# Altium project Phaser_DIOT.PrjPCB (part 4 of 10)

## Sheet DAC.SchDoc: =P_Title
size 420 x 297 mm; EDA_Number: ARTIQ; Projet: ARTIQ/SINARA; Author: G.Kasprowicz; CompanyName: WUT ISE; DrawnBy: G.Kasprowicz; Organization: WUT ISE; Address1: PW ISE; Address2: Nowowiejska 15/19 00-665 Warsaw; Address3: gkasprow@gmail.com; DocumentNumber: 6; Revision: 2; SheetNumber: 6; SheetTotal: 19; ModifiedBy: -; CheckedDate: -; Title2: DAC & filters; DivGrp: WUT ISE; Designer: G.Kasprowicz; ModifiedDate: -; ProjectName: Sensor Box
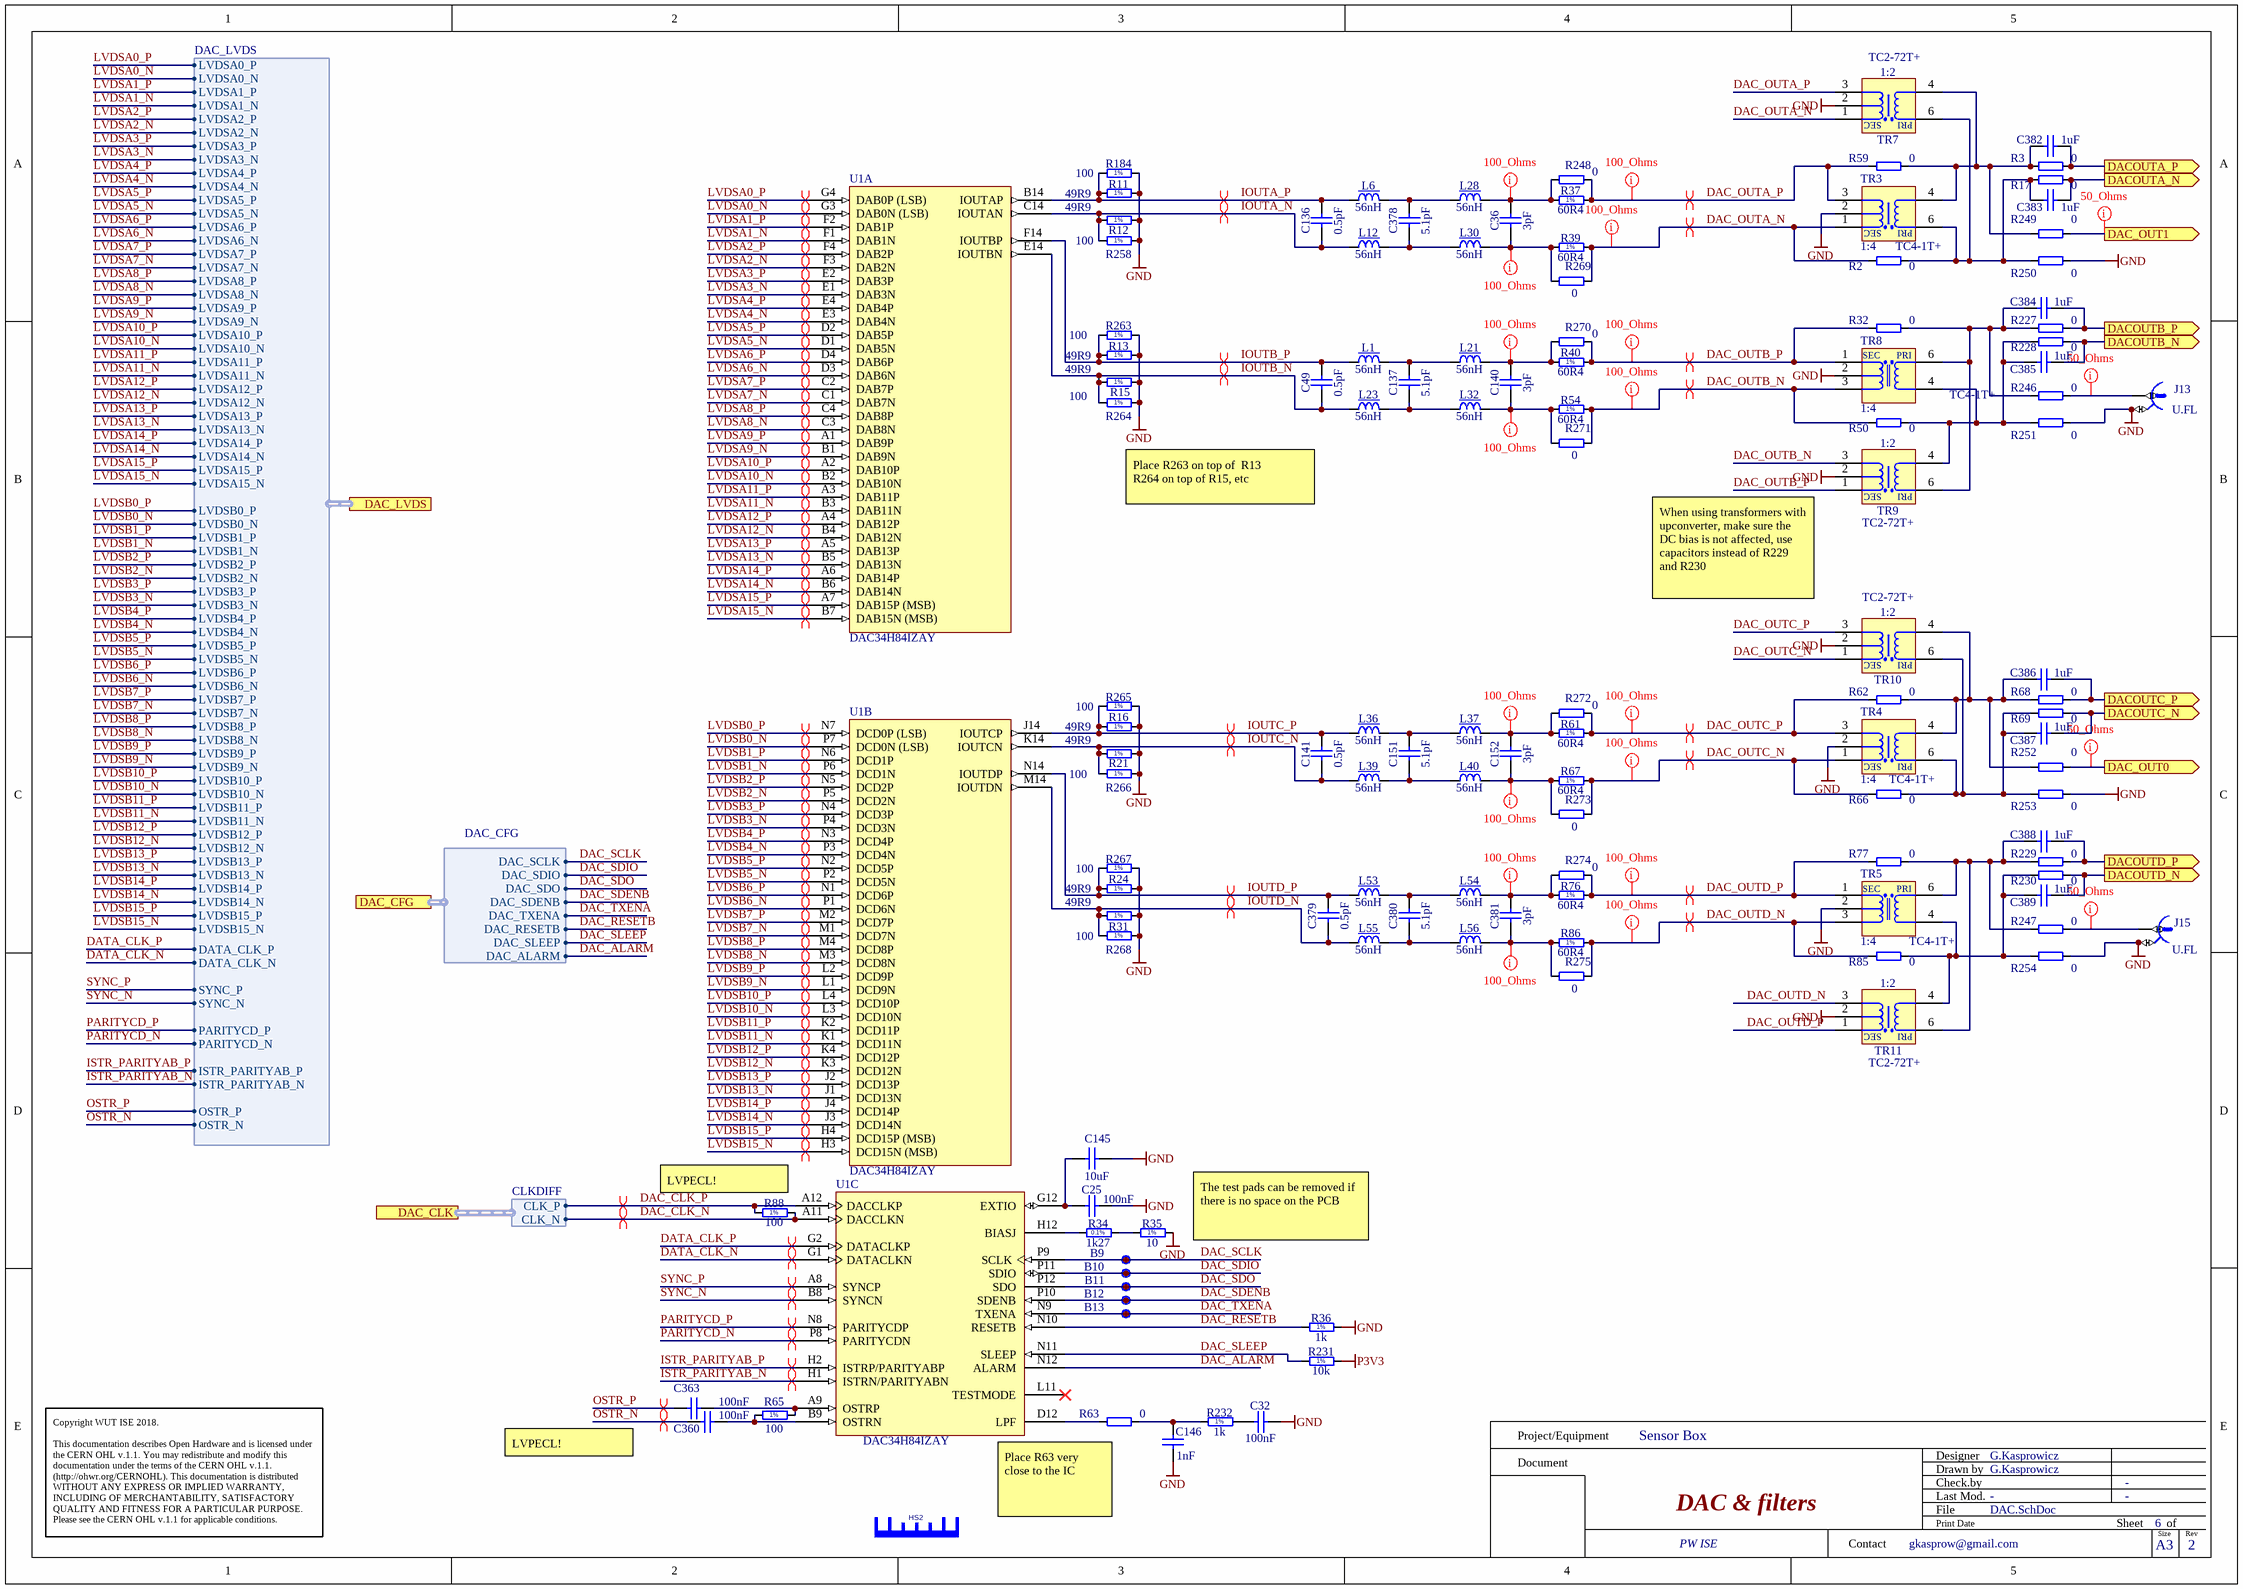
[diagram p7: DAC.SchDoc]

### Parts
B9  SMD Pad  [C100]  (value not drawn)
B10  SMD Pad  [C100]  (value not drawn)
B11  SMD Pad  [C100]  (value not drawn)
B12  SMD Pad  [C100]  (value not drawn)
B13  SMD Pad  [C100]  (value not drawn)
C25  100nF  [CAPC1005X55N]
C32  100nF  [CAPC1608X90N]
C36  3pF  [CAPC1608X87N]
C49  0.5pF  [CAPC1608X87N]
C136  0.5pF  [CAPC1608X87N]
C137  5.1pF  [CAPC1608X87N]
C140  3pF  [CAPC1608X87N]
C141  0.5pF  [CAPC1608X87N]
C145  10uF  [CAPC2012X95N]
C146  1nF  [CAPC1608X90N]
C151  5.1pF  [CAPC1608X87N]
C152  3pF  [CAPC1608X87N]
C360  100nF  [CAPC1005X55N]
C363  100nF  [CAPC1005X55N]
C378  5.1pF  [CAPC1608X87N]
C379  0.5pF  [CAPC1608X87N]
C380  5.1pF  [CAPC1608X87N]
C381  3pF  [CAPC1608X87N]
C382  1uF  [CAPC1005X55N]
C383  1uF  [CAPC1005X55N]
C384  1uF  [CAPC1005X55N]
C385  1uF  [CAPC1005X55N]
C386  1uF  [CAPC1005X55N]
C387  1uF  [CAPC1005X55N]
C388  1uF  [CAPC1005X55N]
C389  1uF  [CAPC1005X55N]
HS2  Heat Sink No Pad  [HSINK_HSB03-121218]  (value not drawn)
J13  U.FL  [HIROSE_U.FL-R-SMT-1(10)]
J15  U.FL  [HIROSE_U.FL-R-SMT-1(10)]
L1  56nH  [IND_MURATA_LQW18AS_0Z]
L6  56nH  [IND_MURATA_LQW18AS_0Z]
L12  56nH  [IND_MURATA_LQW18AS_0Z]
L21  56nH  [IND_MURATA_LQW18AS_0Z]
L23  56nH  [IND_MURATA_LQW18AS_0Z]
L28  56nH  [IND_MURATA_LQW18AS_0Z]
L30  56nH  [IND_MURATA_LQW18AS_0Z]
L32  56nH  [IND_MURATA_LQW18AS_0Z]
L36  56nH  [IND_MURATA_LQW18AS_0Z]
L37  56nH  [IND_MURATA_LQW18AS_0Z]
L39  56nH  [IND_MURATA_LQW18AS_0Z]
L40  56nH  [IND_MURATA_LQW18AS_0Z]
L53  56nH  [IND_MURATA_LQW18AS_0Z]
L54  56nH  [IND_MURATA_LQW18AS_0Z]
L55  56nH  [IND_MURATA_LQW18AS_0Z]
L56  56nH  [IND_MURATA_LQW18AS_0Z]
R2  0  [RESC1005X40N]
R3  0  [RESC1005X40N]
R11  49R9  [RESC1005X40N]
R12  49R9  [RESC1005X40N]
R13  49R9  [RESC1005X40N]
R15  49R9  [RESC1005X40N]
R16  49R9  [RESC1005X40N]
R17  0  [RESC1005X40N]
R21  49R9  [RESC1005X40N]
R24  49R9  [RESC1005X40N]
R31  49R9  [RESC1005X40N]
R32  0  [RESC1005X40N]
R34  1k27  [RESC1608X55N]
R35  10  [RESC1005X40N]
R36  1k  [RESC1608X55N]
R37  60R4  [RESC1005X40N]
R39  60R4  [RESC1005X40N]
R40  60R4  [RESC1005X40N]
R50  0  [RESC1005X40N]
R54  60R4  [RESC1005X40N]
R59  0  [RESC1005X40N]
R61  60R4  [RESC1005X40N]
R62  0  [RESC1005X40N]
R63  0  [RESC1005X40N]
R65  100  [RESC0603X28N]
R66  0  [RESC1005X40N]
R67  60R4  [RESC1005X40N]
R68  0  [RESC1005X40N]
R69  0  [RESC1005X40N]
R76  60R4  [RESC1005X40N]
R77  0  [RESC1005X40N]
R85  0  [RESC1005X40N]
R86  60R4  [RESC1005X40N]
R88  100  [RESC0603X28N]
R184  100  [RESC1005X40N]
R227  0  [RESC1005X40N]
R228  0  [RESC1005X40N]
R229  0  [RESC1005X40N]
R230  0  [RESC1005X40N]
R231  10k  [RESC1608X55N]
R232  1k  [RESC1608X55N]
R246  0  [RESC1005X40N]
R247  0  [RESC1005X40N]
R248  0  [RESC1005X40N]
R249  0  [RESC1005X40N]
R250  0  [RESC1005X40N]
R251  0  [RESC1005X40N]
R252  0  [RESC1005X40N]
R253  0  [RESC1005X40N]
R254  0  [RESC1005X40N]
R258  100  [RESC1005X40N]
R263  100  [RESC1005X40N]
R264  100  [RESC1005X40N]
R265  100  [RESC1005X40N]
R266  100  [RESC1005X40N]
R267  100  [RESC1005X40N]
R268  100  [RESC1005X40N]
R269  0  [RESC1005X40N]
R270  0  [RESC1005X40N]
R271  0  [RESC1005X40N]
R272  0  [RESC1005X40N]
R273  0  [RESC1005X40N]
R274  0  [RESC1005X40N]
R275  0  [RESC1005X40N]
TR3  1:4  Manufacturer Part Number: TC4-1T+  [XFMR_MINI-CIRCUITS_AT224]
TR4  1:4  Manufacturer Part Number: TC4-1T+  [XFMR_MINI-CIRCUITS_AT224]
TR5  1:4  Manufacturer Part Number: TC4-1T+  [XFMR_MINI-CIRCUITS_AT224]
TR7  1:2  Manufacturer Part Number: TC2-72T+  [XFMR_MINI-CIRCUITS_AT1521]
TR8  1:4  Manufacturer Part Number: TC4-1T+  [XFMR_MINI-CIRCUITS_AT224]
TR9  1:2  Manufacturer Part Number: TC2-72T+  [XFMR_MINI-CIRCUITS_AT1521]
TR10  1:2  Manufacturer Part Number: TC2-72T+  [XFMR_MINI-CIRCUITS_AT1521]
TR11  1:2  Manufacturer Part Number: TC2-72T+  [XFMR_MINI-CIRCUITS_AT1521]
U1  DAC34H84IZAY  [TI-ZAY196]  (parts A,B,C of 5)

### Ports
DAC_CFG (harness DAC_CFG), DAC_CLK (harness CLKDIFF), DAC_LVDS (harness DAC_LVDS), DAC_OUT0 (out), DAC_OUT1 (out), DACOUTA_N (out), DACOUTA_P (out), DACOUTB_N (out), DACOUTB_P (out), DACOUTC_N (out), DACOUTC_P (out), DACOUTD_N (out), DACOUTD_P (out)

### Harnesses
DAC_CFG: DAC_SCLK, DAC_SDIO, DAC_SDO, DAC_SDENB, DAC_TXENA, DAC_RESETB, DAC_SLEEP, DAC_ALARM
CLKDIFF: CLK_N, CLK_P
DAC_LVDS: LVDSA0_P, LVDSA0_N, LVDSA1_P, LVDSA1_N, LVDSA2_P, LVDSA2_N, LVDSA3_P, LVDSA3_N, LVDSA4_P, LVDSA4_N, LVDSA5_P, LVDSA5_N, LVDSA6_P, LVDSA6_N, LVDSA7_P, LVDSA7_N, LVDSA8_P, LVDSA8_N, LVDSA9_P, LVDSA9_N, LVDSA10_P, LVDSA10_N, LVDSA11_P, LVDSA11_N, LVDSA12_P, LVDSA12_N, LVDSA13_P, LVDSA13_N, LVDSA14_P, LVDSA14_N, LVDSA15_P, LVDSA15_N, LVDSB0_P, LVDSB0_N, LVDSB1_P, LVDSB1_N, LVDSB2_P, LVDSB2_N, LVDSB3_P, LVDSB3_N, LVDSB4_P, LVDSB4_N, LVDSB5_P, LVDSB5_N, LVDSB6_P, LVDSB6_N, LVDSB7_P, LVDSB7_N, LVDSB8_P, LVDSB8_N, LVDSB9_P, LVDSB9_N, LVDSB10_P, LVDSB10_N, LVDSB11_P, LVDSB11_N, LVDSB12_P, LVDSB12_N, LVDSB13_P, LVDSB13_N, LVDSB14_P, LVDSB14_N, LVDSB15_P, LVDSB15_N, DATA_CLK_P, DATA_CLK_N, SYNC_P, SYNC_N, PARITYCD_P, PARITYCD_N, ISTR_PARITYAB_P, ISTR_PARITYAB_N, OSTR_P, OSTR_N

### Nets
GND: C25.2 C32.2 C145.1 C146.1 J13.2 J15.2 R11.2 R12.2 R13.2 R15.2 R16.2 R21.2 R24.2 R31.2 R35.2 R36.2 R184.2 R250.1 R251.1 R253.1 R254.1 R258.2 R263.2 R264.2 R265.2 R266.2 R267.2 R268.2 TR3.2(SCT) TR4.2(SCT) TR5.2(SCT) TR7.2(NC) TR8.2(SCT) TR9.2(NC) TR10.2(NC) TR11.2(NC)
P3V3: R231.2
BBI_N: C383.2 R17.1 ; port DACOUTA_N
BBI_N: C387.2 R69.1 ; port DACOUTC_N  [a separate net that carries the same name]
BBI_P: C382.2 R3.1 ; port DACOUTA_P
BBI_P: C386.2 R68.1 ; port DACOUTC_P  [a separate net that carries the same name]
BBQ_N: C385.2 R228.1 ; port DACOUTB_N
BBQ_N: C389.2 R230.1 ; port DACOUTD_N  [a separate net that carries the same name]
BBQ_P: C384.2 R227.1 ; port DACOUTB_P
BBQ_P: C388.2 R229.1 ; port DACOUTD_P  [a separate net that carries the same name]
DAC_ALARM: U1.N12(ALARM) ; port DAC_CFG.DAC_ALARM
DAC_CLK_N: R88.2 U1.A11(DACCLKN) ; port DAC_CLK.CLK_N
DAC_CLK_P: R88.1 U1.A12(DACCLKP) ; port DAC_CLK.CLK_P
DAC_OUTA_N: R2.2 R39.2 R269.1 TR3.1(SDOT) TR7.1(SDOT)
DAC_OUTA_P: R37.2 R59.2 R248.1 TR3.3(S) TR7.3(S)
DAC_OUTB_N: R50.2 R54.2 R271.1 TR8.3(S) TR9.3(S)
DAC_OUTB_P: R32.2 R40.2 R270.1 TR8.1(SDOT) TR9.1(SDOT)
DAC_OUTC_N: R66.2 R67.2 R273.1 TR4.1(SDOT) TR10.1(SDOT)
DAC_OUTC_P: R61.2 R62.2 R272.1 TR4.3(S) TR10.3(S)
DAC_OUTD_N: R85.2 R86.2 R275.1 TR5.3(S) TR11.3(S)
DAC_OUTD_P: R76.2 R77.2 R274.1 TR5.1(SDOT) TR11.1(SDOT)
DAC_RESETB: R36.1 U1.N10(RESETB) ; port DAC_CFG.DAC_RESETB
DAC_SCLK: B9.1 U1.P9(SCLK) ; port DAC_CFG.DAC_SCLK
DAC_SDENB: B12.1 U1.P10(SDENB) ; port DAC_CFG.DAC_SDENB
DAC_SDIO: B10.1 U1.P11(SDIO) ; port DAC_CFG.DAC_SDIO
DAC_SDO: B11.1 U1.P12(SDO) ; port DAC_CFG.DAC_SDO
DAC_SLEEP: R231.1 U1.N11(SLEEP) ; port DAC_CFG.DAC_SLEEP
DAC_TXENA: B13.1 U1.N9(TXENA) ; port DAC_CFG.DAC_TXENA
DATA_CLK_N: U1.G1(DATACLKN) ; port DAC_LVDS.DATA_CLK_N
DATA_CLK_P: U1.G2(DATACLKP) ; port DAC_LVDS.DATA_CLK_P
IOUTA_N: C136.1 L12.1 R12.1 R258.1 U1.C14(IOUTAN)
IOUTA_P: C136.2 L6.1 R11.1 R184.1 U1.B14(IOUTAP)
IOUTB_N: C49.1 L23.1 R15.1 R264.1 U1.E14(IOUTBN)
IOUTB_P: C49.2 L1.1 R13.1 R263.1 U1.F14(IOUTBP)
IOUTC_N: C141.1 L39.1 R21.1 R266.1 U1.K14(IOUTCN)
IOUTC_P: C141.2 L36.1 R16.1 R265.1 U1.J14(IOUTCP)
IOUTD_N: C379.1 L55.1 R31.1 R268.1 U1.M14(IOUTDN)
IOUTD_P: C379.2 L53.1 R24.1 R267.1 U1.N14(IOUTDP)
ISTR_PARITYAB_N: U1.H1(ISTRN/PARITYABN) ; port DAC_LVDS.ISTR_PARITYAB_N
ISTR_PARITYAB_P: U1.H2(ISTRP/PARITYABP) ; port DAC_LVDS.ISTR_PARITYAB_P
LVDSA0_N: U1.G3(DAB0N_(LSB)) ; port DAC_LVDS.LVDSA0_N
LVDSA0_P: U1.G4(DAB0P_(LSB)) ; port DAC_LVDS.LVDSA0_P
LVDSA1_N: U1.F1(DAB1N) ; port DAC_LVDS.LVDSA1_N
LVDSA1_P: U1.F2(DAB1P) ; port DAC_LVDS.LVDSA1_P
LVDSA2_N: U1.F3(DAB2N) ; port DAC_LVDS.LVDSA2_N
LVDSA2_P: U1.F4(DAB2P) ; port DAC_LVDS.LVDSA2_P
LVDSA3_N: U1.E1(DAB3N) ; port DAC_LVDS.LVDSA3_N
LVDSA3_P: U1.E2(DAB3P) ; port DAC_LVDS.LVDSA3_P
LVDSA4_N: U1.E3(DAB4N) ; port DAC_LVDS.LVDSA4_N
LVDSA4_P: U1.E4(DAB4P) ; port DAC_LVDS.LVDSA4_P
LVDSA5_N: U1.D1(DAB5N) ; port DAC_LVDS.LVDSA5_N
LVDSA5_P: U1.D2(DAB5P) ; port DAC_LVDS.LVDSA5_P
LVDSA6_N: U1.D3(DAB6N) ; port DAC_LVDS.LVDSA6_N
LVDSA6_P: U1.D4(DAB6P) ; port DAC_LVDS.LVDSA6_P
LVDSA7_N: U1.C1(DAB7N) ; port DAC_LVDS.LVDSA7_N
LVDSA7_P: U1.C2(DAB7P) ; port DAC_LVDS.LVDSA7_P
LVDSA8_N: U1.C3(DAB8N) ; port DAC_LVDS.LVDSA8_N
LVDSA8_P: U1.C4(DAB8P) ; port DAC_LVDS.LVDSA8_P
LVDSA9_N: U1.B1(DAB9N) ; port DAC_LVDS.LVDSA9_N
LVDSA9_P: U1.A1(DAB9P) ; port DAC_LVDS.LVDSA9_P
LVDSA10_N: U1.B2(DAB10N) ; port DAC_LVDS.LVDSA10_N
LVDSA10_P: U1.A2(DAB10P) ; port DAC_LVDS.LVDSA10_P
LVDSA11_N: U1.B3(DAB11N) ; port DAC_LVDS.LVDSA11_N
LVDSA11_P: U1.A3(DAB11P) ; port DAC_LVDS.LVDSA11_P
LVDSA12_N: U1.B4(DAB12N) ; port DAC_LVDS.LVDSA12_N
LVDSA12_P: U1.A4(DAB12P) ; port DAC_LVDS.LVDSA12_P
LVDSA13_N: U1.B5(DAB13N) ; port DAC_LVDS.LVDSA13_N
LVDSA13_P: U1.A5(DAB13P) ; port DAC_LVDS.LVDSA13_P
LVDSA14_N: U1.B6(DAB14N) ; port DAC_LVDS.LVDSA14_N
LVDSA14_P: U1.A6(DAB14P) ; port DAC_LVDS.LVDSA14_P
LVDSA15_N: U1.B7(DAB15N_(MSB)) ; port DAC_LVDS.LVDSA15_N
LVDSA15_P: U1.A7(DAB15P_(MSB)) ; port DAC_LVDS.LVDSA15_P
LVDSB0_N: U1.P7(DCD0N_(LSB)) ; port DAC_LVDS.LVDSB0_N
LVDSB0_P: U1.N7(DCD0P_(LSB)) ; port DAC_LVDS.LVDSB0_P
LVDSB1_N: U1.P6(DCD1N) ; port DAC_LVDS.LVDSB1_N
LVDSB1_P: U1.N6(DCD1P) ; port DAC_LVDS.LVDSB1_P
LVDSB2_N: U1.P5(DCD2N) ; port DAC_LVDS.LVDSB2_N
LVDSB2_P: U1.N5(DCD2P) ; port DAC_LVDS.LVDSB2_P
LVDSB3_N: U1.P4(DCD3N) ; port DAC_LVDS.LVDSB3_N
LVDSB3_P: U1.N4(DCD3P) ; port DAC_LVDS.LVDSB3_P
LVDSB4_N: U1.P3(DCD4N) ; port DAC_LVDS.LVDSB4_N
LVDSB4_P: U1.N3(DCD4P) ; port DAC_LVDS.LVDSB4_P
LVDSB5_N: U1.P2(DCD5N) ; port DAC_LVDS.LVDSB5_N
LVDSB5_P: U1.N2(DCD5P) ; port DAC_LVDS.LVDSB5_P
LVDSB6_N: U1.P1(DCD6N) ; port DAC_LVDS.LVDSB6_N
LVDSB6_P: U1.N1(DCD6P) ; port DAC_LVDS.LVDSB6_P
LVDSB7_N: U1.M1(DCD7N) ; port DAC_LVDS.LVDSB7_N
LVDSB7_P: U1.M2(DCD7P) ; port DAC_LVDS.LVDSB7_P
LVDSB8_N: U1.M3(DCD8N) ; port DAC_LVDS.LVDSB8_N
LVDSB8_P: U1.M4(DCD8P) ; port DAC_LVDS.LVDSB8_P
LVDSB9_N: U1.L1(DCD9N) ; port DAC_LVDS.LVDSB9_N
LVDSB9_P: U1.L2(DCD9P) ; port DAC_LVDS.LVDSB9_P
LVDSB10_N: U1.L3(DCD10N) ; port DAC_LVDS.LVDSB10_N
LVDSB10_P: U1.L4(DCD10P) ; port DAC_LVDS.LVDSB10_P
LVDSB11_N: U1.K1(DCD11N) ; port DAC_LVDS.LVDSB11_N
LVDSB11_P: U1.K2(DCD11P) ; port DAC_LVDS.LVDSB11_P
LVDSB12_N: U1.K3(DCD12N) ; port DAC_LVDS.LVDSB12_N
LVDSB12_P: U1.K4(DCD12P) ; port DAC_LVDS.LVDSB12_P
LVDSB13_N: U1.J1(DCD13N) ; port DAC_LVDS.LVDSB13_N
LVDSB13_P: U1.J2(DCD13P) ; port DAC_LVDS.LVDSB13_P
LVDSB14_N: U1.J3(DCD14N) ; port DAC_LVDS.LVDSB14_N
LVDSB14_P: U1.J4(DCD14P) ; port DAC_LVDS.LVDSB14_P
LVDSB15_N: U1.H3(DCD15N_(MSB)) ; port DAC_LVDS.LVDSB15_N
LVDSB15_P: U1.H4(DCD15P_(MSB)) ; port DAC_LVDS.LVDSB15_P
OSTR_N: C360.1 ; port DAC_LVDS.OSTR_N
OSTR_P: C363.1 ; port DAC_LVDS.OSTR_P
PARITYCD_N: U1.P8(PARITYCDN) ; port DAC_LVDS.PARITYCD_N
PARITYCD_P: U1.N8(PARITYCDP) ; port DAC_LVDS.PARITYCD_P
SYNC_N: U1.B8(SYNCN) ; port DAC_LVDS.SYNC_N
SYNC_P: U1.A8(SYNCP) ; port DAC_LVDS.SYNC_P
NetC25_1: C25.1 C145.2 U1.G12(EXTIO)
NetC32_1: C32.1 R232.2
NetC36_1: C36.1 L30.2 R39.1 R269.2
NetC36_2: C36.2 L28.2 R37.1 R248.2
NetC137_1: C137.1 L23.2 L32.1
NetC137_2: C137.2 L1.2 L21.1
NetC140_1: C140.1 L32.2 R54.1 R271.2
NetC140_2: C140.2 L21.2 R40.1 R270.2
NetC146_2: C146.2 R63.1 R232.1
NetC151_1: C151.1 L39.2 L40.1
NetC151_2: C151.2 L36.2 L37.1
NetC152_1: C152.1 L40.2 R67.1 R273.2
NetC152_2: C152.2 L37.2 R61.1 R272.2
NetC270A_2: R252.1 ; port DAC_OUT0
NetC270B_2: R249.1 ; port DAC_OUT1
NetC360_2: C360.2 R65.1 U1.B9(OSTRN)
NetC363_2: C363.2 R65.2 U1.A9(OSTRP)
NetC378_1: C378.1 L12.2 L30.1
NetC378_2: C378.2 L6.2 L28.1
NetC380_1: C380.1 L55.2 L56.1
NetC380_2: C380.2 L53.2 L54.1
NetC381_1: C381.1 L56.2 R86.1 R275.2
NetC381_2: C381.2 L54.2 R76.1 R274.2
NetC382_1: C382.1 R3.2 R59.1 R249.2 TR3.4(P) TR7.4(P)
NetC383_1: C383.1 R2.1 R17.2 R250.2 TR3.6(PDOT) TR7.6(PDOT)
NetC384_1: C384.1 R32.1 R227.2 R246.2 TR8.6(PDOT) TR9.6(PDOT)
NetC385_1: C385.1 R50.1 R228.2 R251.2 TR8.4(P) TR9.4(P)
NetC386_1: C386.1 R62.1 R68.2 R252.2 TR4.4(P) TR10.4(P)
NetC387_1: C387.1 R66.1 R69.2 R253.2 TR4.6(PDOT) TR10.6(PDOT)
NetC388_1: C388.1 R77.1 R229.2 R247.2 TR5.6(PDOT) TR11.6(PDOT)
NetC389_1: C389.1 R85.1 R230.2 R254.2 TR5.4(P) TR11.4(P)
NetJ13_1: J13.1 R246.1
NetJ15_1: J15.1 R247.1
NetR34_1: R34.1 U1.H12(BIASJ)
NetR34_2: R34.2 R35.1
NetR63_2: R63.2 U1.D12(LPF)

Not connected (* = marked no-connect by the designer): U1 L11(TESTMODE)*

### Layout directives
differential pair; differential pair class I_analog: IOUTA_N, IOUTA_P, IOUTB_N, IOUTB_P, IOUTC_N, IOUTC_P, IOUTD_N, IOUTD_P
differential pair; differential pair class LVPECL: DAC_CLK_N, DAC_CLK_P
differential pair: DAC_OUTA_N, DAC_OUTA_P, DAC_OUTB_N, DAC_OUTB_P, DAC_OUTC_N, DAC_OUTC_P, DAC_OUTD_N, DAC_OUTD_P
net class 100_Ohms: DAC_OUTA_N, DAC_OUTA_P, DAC_OUTB_N, DAC_OUTB_P, DAC_OUTC_N, DAC_OUTC_P, DAC_OUTD_N, DAC_OUTD_P, NetC36_1, NetC36_2, NetC140_1, NetC140_2, NetC152_1, NetC152_2, NetC381_1, NetC381_2
differential pair; differential pair class Diff_100Ohm; net class DAC: DATA_CLK_N, DATA_CLK_P, ISTR_PARITYAB_N, ISTR_PARITYAB_P, LVDSA0_N, LVDSA0_P, LVDSA1_N, LVDSA1_P, LVDSA2_N, LVDSA2_P, LVDSA3_N, LVDSA3_P, LVDSA4_N, LVDSA4_P, LVDSA5_N, LVDSA5_P, LVDSA6_N, LVDSA6_P, LVDSA7_N, LVDSA7_P, LVDSA8_N, LVDSA8_P, LVDSA9_N, LVDSA9_P, LVDSA10_N, LVDSA10_P, LVDSA11_N, LVDSA11_P, LVDSA12_N, LVDSA12_P, LVDSA13_N, LVDSA13_P, LVDSA14_N, LVDSA14_P, LVDSA15_N, LVDSA15_P, LVDSB0_N, LVDSB0_P, LVDSB1_N, LVDSB1_P, LVDSB2_N, LVDSB2_P, LVDSB3_N, LVDSB3_P, LVDSB4_N, LVDSB4_P, LVDSB5_N, LVDSB5_P, LVDSB6_N, LVDSB6_P, LVDSB7_N, LVDSB7_P, LVDSB8_N, LVDSB8_P, LVDSB9_N, LVDSB9_P, LVDSB10_N, LVDSB10_P, LVDSB11_N, LVDSB11_P, LVDSB12_N, LVDSB12_P, LVDSB13_N, LVDSB13_P, LVDSB14_N, LVDSB14_P, LVDSB15_N, LVDSB15_P, PARITYCD_N, PARITYCD_P, SYNC_N, SYNC_P
differential pair; differential pair class LVPECL; net class DAC: OSTR_N, OSTR_P
net class 50_Ohms: NetC270A_2, NetC270B_2, NetJ13_1, NetJ15_1

### Notes on the sheet
- Place R263 on top of  R13
  R264 on top of R15, etc
- When using transformers with upconverter, make sure the DC bias is not affected, use capacitors instead of R229 and R230
- (near R88) LVPECL!
- (near R35) The test pads can be removed if there is no space on the PCB
- LVPECL!
- Place R63 very close to the IC
- Project/Equipment
- Document
- Designer
- Drawn by
- Check.by
- Copyright WUT ISE 2018.
  This documentation describes Open Hardware and is licensed under the CERN OHL v.1.1. You may redistribute and modify this documentation under the terms of the CERN OHL v.1.1. (http://ohwr.org/CERNOHL). This documentation is distributed WITHOUT ANY EXPRESS OR IMPLIED WARRANTY, INCLUDING OF MERCHANTABILITY, SATISFACTORY QUALITY AND FITNESS FOR A PARTICULAR PURPOSE. Please see the CERN OHL v.1.1 for applicable conditions.
- Contact
- File
- Last Mod.
- Print Date
- Sheet
- Size
- A3
- of
- Rev
- (in symbol R0201_100R_1%_0.05W_200PPM) 1%
- (in symbol R0402_10R_1%_0.0625W_200PPM) 1%
- (in symbol R0402_49R9_1%_0.0625W_100PPM) 1%
- (in symbol R0402_60R4_1%_0.0625W_100PPM) 1%
- (in symbol R0402_100R_1%_0.1W_100PPM) 1%
- (in symbol R0603_1K27_0.1%_0.063W_10PPM) 0.1%
- (in symbol R0603_1K_1%_0.1W_100PPM) 1%
- (in symbol R0603_10K_1%_0.1W_100PPM) 1%
- (in symbol XFMR_MINI-CIRCUITS_TC2-72T+) SEC; PRI
- (in symbol XFMR_MINI-CIRCUITS_TC4-1T+) SEC; PRI
- (in symbol XFMR_MINI-CIRCUITS_ADT1-1WT+) SEC; PRI

### Library data of the parts
B9-B13 = SMD_PAD_D1MM: Through Hole Pad; Part Description: 1mm Diameter SMD Pad; Mounted: No; Part Number: SMD_PAD_D1MM; Component Kind: Standard (No BOM); Component Type: Standard (No BOM); Pin Count: 1; Family: SMD Pad; Socket: No; SMD: No; Sense: No; Status: None; ComponentHeight: 0mm; HelpURL: Undefined; Author: CERN DEM JLC; CreateDate: 10.10.2017; LatestRevisionDate: 10.10.2017; PackageDescription: 1mm Diameter SMD Pad
C25 C360 C363 = CC0402_100NF_16V_10%_X5R: as C88 on sheet ADC_2CH; Part Number: CC0402_100NF_16V_10%_X5R; Component Kind: Standard; Component Type: Standard; Pin Count: 2; Value: 100nF; Status: None; Manufacturer Part Number: CC0402_100NF_16V_10%_X5R; Case: 0402; Mounted: Yes; Socket: No; SMD: Yes; Sense: No; Manufacturer1 Example: MURATA; Manufacturer1 ComponentHeight: 0.55mm; HelpURL: \\cern.ch\dfs\Applications\Altium\Datasheets\CC0402_X5R_MURATA_GRM.pdf; Author: CERN DEM JLC; CreateDate: 10.12.2013; LatestRevisionDate: 10.12.2013
C32 = CC0603_100NF_100V_10%_X7R: Non-polarised capacitor; Part Description: SMD Multilayer Chip Ceramic Capacitor; Manufacturer: GENERIC; Manufacturer1 Part Number: GRM188R72A104KA35D; Voltage: 100V; TC: X7R; Tolerance: ±10%; Part Number: CC0603_100NF_100V_10%_X7R; Component Kind: Standard; Component Type: Standard; Pin Count: 2; Value: 100nF; Status: None; Manufacturer Part Number: CC0603_100NF_100V_10%_X7R; Case: 0603; Mounted: Yes; Socket: No; SMD: Yes; Sense: No; Manufacturer1 Example: MURATA; Manufacturer1 ComponentHeight: 0.9mm; HelpURL: \\cern.ch\dfs\Applications\Altium\Datasheets\CC0603_MURATA_GRM188R72A104KA35D.pdf; Author: CERN DEM JLC; CreateDate: 11.12.2013; LatestRevisionDate: 11.12.2013
C36 C140 C152 C381 = CC0603_3pF_50V_0,1pF_NP0: Non-polarised capacitor; Value: 3pF
C49 C136 C141 C379 = CC0603_0.5pF_50V_0,05pF_NP0: Non-polarised capacitor; Value: 0.5pF
C137 C151 C378 C380 = CC0603_5.1pF_50V_0.1pF_NP0: Non-polarised capacitor; Value: 5.1pF
C145 = CC0805_10UF_25V_10%_X5R: as C2 on sheet ADC_2CH; Part Number: CC0805_10UF_25V_10%_X5R; Component Kind: Standard; Component Type: Standard; Pin Count: 2; Value: 10uF; Status: Preferred; Manufacturer Part Number: CC0805_10UF_25V_10%_X5R; Case: 0805; Mounted: Yes; Socket: No; SMD: Yes; Sense: No; Manufacturer1 Example: MURATA; Manufacturer1 ComponentHeight: 0.95mm; HelpURL: \\cern.ch\dfs\Applications\Altium\Datasheets\CC0805_X5R_MURATA_GRM.pdf; Author: CERN DEM JLC; CreateDate: 25.10.2012; LatestRevisionDate: 06.09.2016
C146 = CC0603_1NF_50V_1%_NP0: as C224 on sheet Input_channel; Part Number: CC0603_1NF_50V_1%_NP0; Component Kind: Standard; Component Type: Standard; Pin Count: 2; Value: 1nF; Status: None; Manufacturer Part Number: CC0603_1NF_50V_1%_NP0; Case: 0603; Mounted: Yes; Socket: No; SMD: Yes; Sense: No; Manufacturer1 Example: AVX; Manufacturer1 ComponentHeight: 0.9mm; HelpURL: \\cern.ch\dfs\Applications\Altium\Datasheets\CC0603_C0G_AVX.pdf; Author: CERN DEM JLC; CreateDate: 15.06.2017; LatestRevisionDate: 15.06.2017
C382-C389 = CC0402_1UF_16V_10%_X5R: Non-polarised capacitor; Part Description: SMD Multilayer Chip Ceramic Capacitor; Manufacturer: GENERIC; Manufacturer1 Part Number: C1005X5R1C105KT; Voltage: 16V; TC: X5R; Tolerance: ±10%; Part Number: CC0402_1UF_16V_10%_X5R; Component Kind: Standard; Component Type: Standard; Pin Count: 2; Value: 1uF; Status: Preferred; Manufacturer Part Number: CC0402_1UF_16V_10%_X5R; Case: 0402; Mounted: Yes; Socket: No; SMD: Yes; Sense: No; Manufacturer1 Example: TDK; Manufacturer1 ComponentHeight: 0.55mm; HelpURL: \\cern.ch\dfs\Applications\Altium\Datasheets\CC0402_X5R_TDK_C.pdf; Author: CERN DEM JLC; CreateDate: 25.10.2012; LatestRevisionDate: 25.10.2012
HS2 = HEAT_SINK_BGA_12x12x18: Rth: 27.5K/W - L 12mm x W 12mm x H 18mm Black Anodized Heatsinks for BGA; Part Number: HSB03-121218; Manufacturer: CUI; PressFit: No; Component Kind: Accessories; Component Type: Standard; Pin Count: 0; PackageDescription: Rth: 24K/W - L 12mm x W 12mm x H 18mm Black Anodized Heatsinks for BGA; Mounted: Yes; Socket: No; SMD: No; Sense: No; Status: None; Part Description: Rth: 27.5K/W - L 12mm x W 12mm x H 18mm Black Anodized Heatsinks for BGA; Manufacturer Part Number: HSB03-121218; ComponentHeight: 10mm; HelpURL: \\cern.ch\dfs\Applications\Altium\Datasheets\HSINK_FISCHER_ICK SMD A 13 SA.pdf; Author: GK; CreateDate: 28.05.2015; LatestRevisionDate: 28.05.2015
J13 J15 = HIROSE_U.FL-R-SMT-1(10): Part Description: Up to 6GHz Ultra Small Surface Mount Male Coaxial Connectors U.FL Series; Manufacturer: HIROSE (HRS); PressFit: No; Component Kind: Standard; Component Type: Standard; Pin Count: 2; Mounted: Yes; Socket: No; Sense: No; SMD: Yes; Status: None; Manufacturer Part Number: U.FL-R-SMT-1(10); ComponentHeight: 1.25mm; HelpURL: \\cern.ch\dfs\Applications\Altium\Datasheets\HIROSE_U.FL-R-SMT-1(10).pdf; Author: CERN DEM JLC; CreateDate: 24.03.2010; LatestRevisionDate: 24.03.2010; Part Number: HIROSE_U.FL-R-SMT-1(10); Family: U.FL
L1 L6 L12 L21 L23 L28 L30 L32 L36 L37 L39 L40 L53-L56 = IND0603_56NH_2%_MURATA_LQW18AS56NG0ZD: Inductor With Core; Part Description: Wire Wound RF Inductor For Automotive; Manufacturer: MURATA; Power: 600mA; Resistance: 0R31; Tolerance: ±2%; Part Number: IND0603_56NH_2%_MURATA_LQW18AS56NG0ZD; Component Kind: Standard; Component Type: Standard; Pin Count: 2; Value: 56nH; Manufacturer Part Number: LQW18AS56NG0Z; Case: 0603; Mounted: Yes; Socket: No; SMD: Yes; Sense: No; ComponentHeight: 1mm; HelpURL: \\cern.ch\dfs\Applications\Altium\Datasheets\IND_MURATA_LQW18AS56NG0Z.pdf; Author: CERN DEM BC; CreateDate: 23.04.2020; LatestRevisionDate: 23.04.2020
R2 R3 R17 R32 R50 R59 R62 R63 R66 R68 R69 R77 R85 R227-R230 R246-R254 R269-R275 = R0402_0R_JUMPER: as R1 on sheet ADC_2CH; Part Number: R0402_0R_JUMPER; Component Kind: Standard; Component Type: Standard; Pin Count: 2; Value: 0; Status: Not recommended; Manufacturer Part Number: R0402_0R_JUMPER; Case: 0402; Mounted: Yes; Sense: No; Socket: No; SMD: Yes; Manufacturer1 Example: YAGEO PHYCOMP; Manufacturer1 ComponentHeight: 0.4mm; HelpURL: \\cern.ch\dfs\Applications\Altium\Datasheets\R0402_Phycomp_RC0402.pdf; Author: CERN DEM JLC; CreateDate: 2007-12-03; LatestRevisionDate: 2012-10-17
R11-R13 R15 R16 R21 R24 R31 = R0402_49R9_1%_0.0625W_100PPM: Resistor - 1%; Part Description: General Purpose Thick Film Chip Resistor; Manufacturer: GENERIC; Manufacturer1 Part Number: 232270674999L or RC0402FR-0749R9L; TC: ±100ppm/°C; PressFit: No; Part Number: R0402_49R9_1%_0.0625W_100PPM; Component Kind: Standard; Component Type: Standard; Pin Count: 2; Value: 49R9; Status: Not Recommended; Power: 0.0625W; Tolerance: ±1%; Manufacturer Part Number: R0402_49R9_1%_0.0625W_100PPM; Case: 0402; Mounted: Yes; Sense: No; Socket: No; SMD: Yes; Manufacturer1 Example: YAGEO PHYCOMP; Manufacturer1 ComponentHeight: 0.4mm; HelpURL: \\cern.ch\dfs\Applications\Altium\Datasheets\R0402_Phycomp_RC0402.pdf; Author: CERN DEM JLC; CreateDate: 24.10.2012; LatestRevisionDate: 24.10.2012
R34 = R0603_1K27_0.1%_0.063W_10PPM: Resistor - 0.1%; Part Description: Thin Film Chip Resistor; Manufacturer: GENERIC; Manufacturer1 Part Number: RN73C1J1K27BTDF; Power: 0.063W; TC: ±10ppm; PressFit: No; Part Number: R0603_1K27_0.1%_0.063W_10PPM; Component Kind: Standard; Component Type: Standard; Pin Count: 2; Value: 1k27; Status: Not Recommended; Tolerance: ±0.1%; Manufacturer Part Number: R0603_1K27_0.1%_0.063W_10PPM; Case: 0603; Mounted: Yes; Sense: No; Socket: No; SMD: Yes; Manufacturer1 Example: TYCO HOLSWORTHY; Manufacturer1 ComponentHeight: 0.5mm; HelpURL: \\cern.ch\dfs\Applications\Altium\Datasheets\R0603_Tyco_RN73.pdf; Author: CERN DEM JLC; CreateDate: 03.12.2007; LatestRevisionDate: 13.03.2008
R35 = R0402_10R_1%_0.0625W_200PPM: Resistor - 1%; Part Description: General Purpose Thick Film Chip Resistor; Manufacturer: GENERIC; Manufacturer1 Part Number: 232270671009L; TC: ±200ppm/°C; PressFit: No; Part Number: R0402_10R_1%_0.0625W_200PPM; Component Kind: Standard; Component Type: Standard; Pin Count: 2; Value: 10; Status: Not Recommended; Power: 0.0625W; Tolerance: ±1%; Manufacturer Part Number: R0402_10R_1%_0.0625W_200PPM; Case: 0402; Mounted: Yes; Sense: No; Socket: No; SMD: Yes; Manufacturer1 Example: YAGEO PHYCOMP; Manufacturer1 ComponentHeight: 0.4mm; HelpURL: \\cern.ch\dfs\Applications\Altium\Datasheets\R0402_Phycomp_RC0402.pdf; Author: CERN DEM JLC; CreateDate: 24.06.2009; LatestRevisionDate: 17.10.2012
R36 R232 = R0603_1K_1%_0.1W_100PPM: Resistor - 1%; Part Description: General Purpose Thick Film Chip Resistor; Manufacturer: GENERIC; Manufacturer1 Part Number: NRC06F1001TRF; Power: 0.1W; TC: ±100ppm/°C; PressFit: No; Part Number: R0603_1K_1%_0.1W_100PPM; Component Kind: Standard; Component Type: Standard; Pin Count: 2; Value: 1k; Status: Preferred; Tolerance: ±1%; Manufacturer Part Number: R0603_1K_1%_0.1W_100PPM; Case: 0603; Mounted: Yes; Sense: No; Socket: No; SMD: Yes; Manufacturer1 Example: NIC COMPONENT; Manufacturer1 ComponentHeight: 0.55mm; HelpURL: \\cern.ch\dfs\Applications\Altium\Datasheets\R0603_NIC_NRC.pdf; Author: CERN DEM JLC; CreateDate: 03.12.2007; LatestRevisionDate: 13.03.2008
R37 R39 R40 R54 R61 R67 R76 R86 = R0402_60R4_1%_0.0625W_100PPM: Resistor - 1%; Part Description: General Purpose Thick Film Chip Resistor; Manufacturer: GENERIC; Manufacturer1 Part Number: RC0402FR-0760R4L; TC: ±100ppm/°C; PressFit: No; Part Number: R0402_60R4_1%_0.0625W_100PPM; Component Kind: Standard; Component Type: Standard; Pin Count: 2; Value: 60R4; Status: Recommended; Power: 0.0625W; Tolerance: ±1%; Manufacturer Part Number: R0402_60R4_1%_0.0625W_100PPM; Case: 0402; Mounted: Yes; Sense: No; Socket: No; SMD: Yes; Manufacturer1 Example: YAGEO; Manufacturer1 ComponentHeight: 0.4mm; HelpURL: \\cern.ch\dfs\Applications\Altium\Datasheets\R0402_Phycomp_RC0402.pdf; Author: GK; CreateDate: 03.12.2007; LatestRevisionDate: 17.10.2012
R65 R88 = R0201_100R_1%_0.05W_200PPM: Resistor - 1%; Part Description: Thick Film Chip Resistor; Manufacturer: GENERIC; Manufacturer1 Part Number: CRCW0201100RFNED; Power: 0.05W; TC: ±200ppm/°C; PressFit: No; Part Number: R0201_100R_1%_0.05W_200PPM; Component Kind: Standard; Component Type: Standard; Pin Count: 2; Value: 100; Status: Not Recommended; Tolerance: ±1%; Manufacturer Part Number: R0201_100R_1%_0.05W_200PPM; Case: 0201; Mounted: Yes; Sense: No; Socket: No; SMD: Yes; Manufacturer1 Example: VISHAY; Manufacturer1 ComponentHeight: 0.27mm; HelpURL: \\cern.ch\dfs\Applications\Altium\Datasheets\R0201_VISHAY_CRCW0201 e3.pdf; Author: CERN DEM JLC; CreateDate: 13.11.2014; LatestRevisionDate: 13.11.2014
R184 R258 R263-R268 = R0402_100R_1%_0.1W_100PPM: Resistor - 1%; Part Description: General Purpose Thick Film Chip Resistor; Manufacturer: GENERIC; Manufacturer Part Number: R0402_100R_1%_0.1W_100PPM_50V; Manufacturer1 Part Number: ERJ2RKF1000X; Power: 0.1W; TC: ±100ppm/°C; PressFit: No; Voltage: 50V; Part Number: R0402_100R_1%_0.1W_100PPM; Component Kind: Standard; Component Type: Standard; Pin Count: 2; Value: 100; Status: Not Recommended; Tolerance: ±1%; Case: 0402; Mounted: Yes; Sense: No; Socket: No; SMD: Yes; Manufacturer1 Example: PANASONIC; Manufacturer1 ComponentHeight: 0.4mm; HelpURL: \\cern.ch\dfs\Applications\Altium\Datasheets\R0402_PANASONIC_ERJ2RK.pdf; Author: CERN DEM JLC; CreateDate: 12.12.2013; LatestRevisionDate: 03.03.2015
R231 = R0603_10K_1%_0.1W_100PPM: Resistor - 1%; Part Description: General Purpose Thick Film Chip Resistor; Manufacturer: GENERIC; Manufacturer1 Part Number: NRC06F1002TRF; Power: 0.1W; TC: ±100ppm/°C; PressFit: No; Part Number: R0603_10K_1%_0.1W_100PPM; Component Kind: Standard; Component Type: Standard; Pin Count: 2; Value: 10k; Status: Preferred; Tolerance: ±1%; Manufacturer Part Number: R0603_10K_1%_0.1W_100PPM; Case: 0603; Mounted: Yes; Sense: No; Socket: No; SMD: Yes; Manufacturer1 Example: NIC COMPONENT; Manufacturer1 ComponentHeight: 0.55mm; HelpURL: \\cern.ch\dfs\Applications\Altium\Datasheets\R0603_NIC_NRC.pdf; Author: CERN DEM JLC; CreateDate: 03.12.2007; LatestRevisionDate: 13.03.2008
TR3-TR5 TR8 = XFMR_MINI-CIRCUITS_TC4-1T+: 50 Ohms 0.5 to 300 MHz RF Transformer; Part Number: XFMR_MINI-CIRCUITS_TC4-1T+; Component Kind: Standard; Component Type: Standard; Pin Count: 6; Value: 1:4; Status: None; Part Description: 50 Ohms 0.5 to 300 MHz RF Transformer; Manufacturer: MINI-CIRCUITS; Mounted: Yes; Socket: No; Sense: No; SMD: Yes; ComponentHeight: 2.84mm; HelpURL: \\cern.ch\dfs\Applications\Altium\Datasheets\XFMR_MINI-CIRCUITS_ADT1-1WT+.pdf; Author: GK; CreateDate: 21.09.2011; LatestRevisionDate: 21.09.2011
TR7 TR9-TR11 = XFMR_MINI-CIRCUITS_TC2-72T+: 50 Ohms 10 to 700MHz RF Transformer; Part Number: XFMR_MINI-CIRCUITS_TC2-72T+; Component Kind: Standard; Component Type: Standard; Pin Count: 5; Value: 1:2; Status: None; Part Description: 50 Ohms 10 to 700MHz RF Transformer; Manufacturer: MINI-CIRCUITS; Mounted: Yes; Socket: No; Sense: No; SMD: Yes; ComponentHeight: 4.06mm; HelpURL: \\cern.ch\dfs\Applications\Altium\Datasheets\XFMR_MINI-CIRCUITS_TC2-72T+.pdf; Author: CERN DEM BC; CreateDate: 17.02.2022; LatestRevisionDate: 17.02.2022
U1 = CMP-0004-01532-1: Quad-Channel, 16-Bit, 1.5 GSPS DAC, -40 to 85 degC, 196-pin BGA (ZAY196), Green (RoHS & no Sb/Br); Manufacturer: Texas Instruments; Interface: Parallel LVDS; Resolution(Bits): 16; SubFamily: High Speed DAC (>10MSPS); Power Consumption(Typ)(mW): 1828; SFDR(dB): 78; DAC Channels: 4; Mounting Technology: Surface Mount; ComponentLink3URL: http://www.ti.com/litv/pdf/mpbga11; PartNumber: DAC34H84IZAY; ComponentLink1Description: Manufacturer URL; Eco-Plan: Green (RoHS & no Sb/Br); PackageDescription: 196-Pin Plastic Ball Grid Array, Body 12 x 12 mm, Pitch 0.8 mm; PackageVersion: 4208324-4/C, 09/2010; PackageReference: ZAY196; ComponentLink1URL: http://www.ti.com/; ComponentLink2URL: http://www.ti.com/general/docs/lit/getliterature.tsp?genericPartNumber=DAC34SH84&fileType=pdf; DatasheetVersion: SLAS808D; ComponentLink3Description: Package Specification; ComponentLink2Description: Datasheet

## Sheet FPGA_CFG_EEM.SchDoc: =P_Title
size 420 x 297 mm; EDA_Number: ARTIQ; Projet: ARTIQ/SINARA; Author: G.Kasprowicz; CompanyName: WUT ISE; DrawnBy: G.Kasprowicz; Organization: WUT ISE; Address1: PW ISE; Address2: Nowowiejska 15/19 00-665 Warsaw; Address3: gkasprow@gmail.com; DocumentNumber: 4; Revision: 2; SheetNumber: 4; SheetTotal: 19; ModifiedBy: -; CheckedDate: -; Title2: FPGA ADC; DivGrp: WUT ISE; Designer: G.Kasprowicz; ModifiedDate: -; ProjectName: Sensor Box
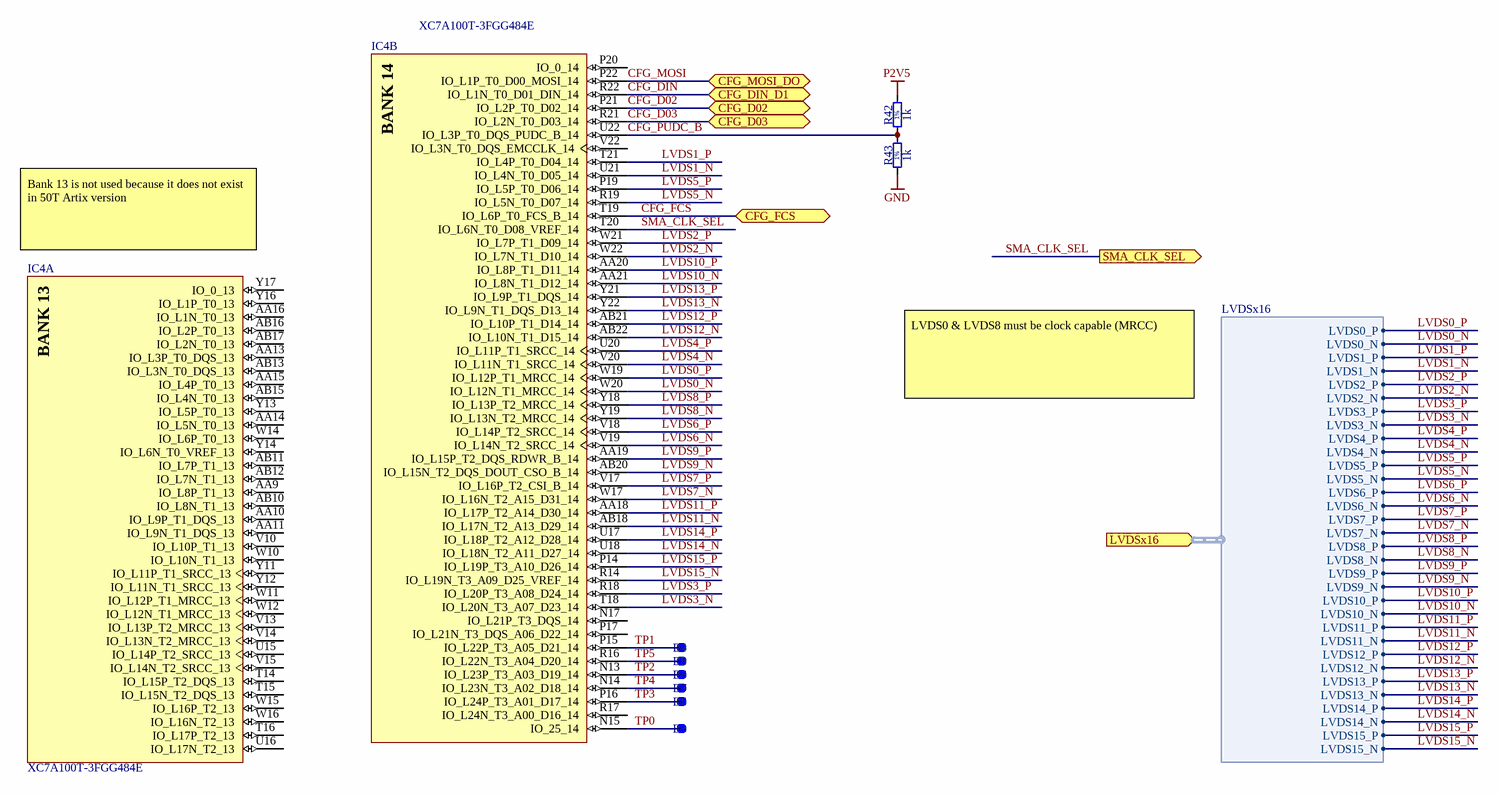
[diagram p8: FPGA_CFG_EEM.SchDoc]

### Parts
(Parts that share a designator on the sheet are numbered #1, #2 ... from top to bottom, then left to right.)
B3  SMD Pad  [C100]  (value not drawn)
B4  SMD Pad  [C100]  (value not drawn)
B5  SMD Pad  [C100]  (value not drawn)
B6  SMD Pad  [C100]  (value not drawn)
B7  SMD Pad  [C100]  (value not drawn)
B8  SMD Pad  [C100]  (value not drawn)
IC4#1  XC7A100T-3FGG484E  [FGG484]  (parts A,B of 10)
R42  1k  [RESC1005X40N]
R43  1k  [RESC1005X40N]

### Ports
CFG_D02 (bidir), CFG_D03 (bidir), CFG_DIN_D1 (bidir), CFG_FCS (bidir), CFG_MOSI_DO (bidir), LVDSx16 (in, harness LVDSx16), SMA_CLK_SEL (out)

### Harnesses
LVDSx16: LVDS0_P, LVDS0_N, LVDS1_P, LVDS1_N, LVDS2_P, LVDS2_N, LVDS3_P, LVDS3_N, LVDS4_P, LVDS4_N, LVDS5_P, LVDS5_N, LVDS6_P, LVDS6_N, LVDS7_P, LVDS7_N, LVDS8_P, LVDS8_N, LVDS9_P, LVDS9_N, LVDS10_P, LVDS10_N, LVDS11_P, LVDS11_N, LVDS12_P, LVDS12_N, LVDS13_P, LVDS13_N, LVDS14_P, LVDS14_N, LVDS15_P, LVDS15_N

### Nets
GND: R43.1
P2V5: R42.2
CFG_D02: IC4#1.P21(IO_L2P_T0_D02_14) ; port CFG_D02
CFG_D03: IC4#1.R21(IO_L2N_T0_D03_14) ; port CFG_D03
CFG_DIN: IC4#1.R22(IO_L1N_T0_D01_DIN_14) ; port CFG_DIN_D1
CFG_FCS: IC4#1.T19(IO_L6P_T0_FCS_B_14) ; port CFG_FCS
CFG_MOSI: IC4#1.P22(IO_L1P_T0_D00_MOSI_14) ; port CFG_MOSI_DO
CFG_PUDC_B: IC4#1.U22(IO_L3P_T0_DQS_PUDC_B_14) R42.1 R43.2
LVDS0_N: IC4#1.W20(IO_L12N_T1_MRCC_14) ; port LVDSx16.LVDS0_N
LVDS0_P: IC4#1.W19(IO_L12P_T1_MRCC_14) ; port LVDSx16.LVDS0_P
LVDS1_N: IC4#1.U21(IO_L4N_T0_D05_14) ; port LVDSx16.LVDS1_N
LVDS1_P: IC4#1.T21(IO_L4P_T0_D04_14) ; port LVDSx16.LVDS1_P
LVDS2_N: IC4#1.W22(IO_L7N_T1_D10_14) ; port LVDSx16.LVDS2_N
LVDS2_P: IC4#1.W21(IO_L7P_T1_D09_14) ; port LVDSx16.LVDS2_P
LVDS3_N: IC4#1.T18(IO_L20N_T3_A07_D23_14) ; port LVDSx16.LVDS3_N
LVDS3_P: IC4#1.R18(IO_L20P_T3_A08_D24_14) ; port LVDSx16.LVDS3_P
LVDS4_N: IC4#1.V20(IO_L11N_T1_SRCC_14) ; port LVDSx16.LVDS4_N
LVDS4_P: IC4#1.U20(IO_L11P_T1_SRCC_14) ; port LVDSx16.LVDS4_P
LVDS5_N: IC4#1.R19(IO_L5N_T0_D07_14) ; port LVDSx16.LVDS5_N
LVDS5_P: IC4#1.P19(IO_L5P_T0_D06_14) ; port LVDSx16.LVDS5_P
LVDS6_N: IC4#1.V19(IO_L14N_T2_SRCC_14) ; port LVDSx16.LVDS6_N
LVDS6_P: IC4#1.V18(IO_L14P_T2_SRCC_14) ; port LVDSx16.LVDS6_P
LVDS7_N: IC4#1.W17(IO_L16N_T2_A15_D31_14) ; port LVDSx16.LVDS7_N
LVDS7_P: IC4#1.V17(IO_L16P_T2_CSI_B_14) ; port LVDSx16.LVDS7_P
LVDS8_N: IC4#1.Y19(IO_L13N_T2_MRCC_14) ; port LVDSx16.LVDS8_N
LVDS8_P: IC4#1.Y18(IO_L13P_T2_MRCC_14) ; port LVDSx16.LVDS8_P
LVDS9_N: IC4#1.AB20(IO_L15N_T2_DQS_DOUT_CSO_B_14) ; port LVDSx16.LVDS9_N
LVDS9_P: IC4#1.AA19(IO_L15P_T2_DQS_RDWR_B_14) ; port LVDSx16.LVDS9_P
LVDS10_N: IC4#1.AA21(IO_L8N_T1_D12_14) ; port LVDSx16.LVDS10_N
LVDS10_P: IC4#1.AA20(IO_L8P_T1_D11_14) ; port LVDSx16.LVDS10_P
LVDS11_N: IC4#1.AB18(IO_L17N_T2_A13_D29_14) ; port LVDSx16.LVDS11_N
LVDS11_P: IC4#1.AA18(IO_L17P_T2_A14_D30_14) ; port LVDSx16.LVDS11_P
LVDS12_N: IC4#1.AB22(IO_L10N_T1_D15_14) ; port LVDSx16.LVDS12_N
LVDS12_P: IC4#1.AB21(IO_L10P_T1_D14_14) ; port LVDSx16.LVDS12_P
LVDS13_N: IC4#1.Y22(IO_L9N_T1_DQS_D13_14) ; port LVDSx16.LVDS13_N
LVDS13_P: IC4#1.Y21(IO_L9P_T1_DQS_14) ; port LVDSx16.LVDS13_P
LVDS14_N: IC4#1.U18(IO_L18N_T2_A11_D27_14) ; port LVDSx16.LVDS14_N
LVDS14_P: IC4#1.U17(IO_L18P_T2_A12_D28_14) ; port LVDSx16.LVDS14_P
LVDS15_N: IC4#1.R14(IO_L19N_T3_A09_D25_VREF_14) ; port LVDSx16.LVDS15_N
LVDS15_P: IC4#1.P14(IO_L19P_T3_A10_D26_14) ; port LVDSx16.LVDS15_P
SMA_CLK_SEL: IC4#1.T20(IO_L6N_T0_D08_VREF_14) ; port SMA_CLK_SEL
TP0: B3.1 IC4#1.N15(IO_25_14)
TP1: B4.1 IC4#1.P15(IO_L22P_T3_A05_D21_14)
TP2: B5.1 IC4#1.N13(IO_L23P_T3_A03_D19_14)
TP3: B6.1 IC4#1.P16(IO_L24P_T3_A01_D17_14)
TP4: B7.1 IC4#1.N14(IO_L23N_T3_A02_D18_14)
TP5: B8.1 IC4#1.R16(IO_L22N_T3_A04_D20_14)

Not connected (* = marked no-connect by the designer): IC4#1 AA9(IO_L8P_T1_13) AA10(IO_L9P_T1_DQS_13) AA11(IO_L9N_T1_DQS_13) AA13(IO_L3P_T0_DQS_13) AA14(IO_L5N_T0_13) AA15(IO_L4P_T0_13) AA16(IO_L1N_T0_13) AB10(IO_L8N_T1_13) AB11(IO_L7P_T1_13) AB12(IO_L7N_T1_13) AB13(IO_L3N_T0_DQS_13) AB15(IO_L4N_T0_13) AB16(IO_L2P_T0_13) AB17(IO_L2N_T0_13) N17(IO_L21P_T3_DQS_14) P17(IO_L21N_T3_DQS_A06_D22_14) P20(IO_0_14) R17(IO_L24N_T3_A00_D16_14) T14(IO_L15P_T2_DQS_13) T15(IO_L15N_T2_DQS_13) T16(IO_L17P_T2_13) U15(IO_L14P_T2_SRCC_13) U16(IO_L17N_T2_13) V10(IO_L10P_T1_13) V13(IO_L13P_T2_MRCC_13) V14(IO_L13N_T2_MRCC_13) V15(IO_L14N_T2_SRCC_13) V22(IO_L3N_T0_DQS_EMCCLK_14) W10(IO_L10N_T1_13) W11(IO_L12P_T1_MRCC_13) W12(IO_L12N_T1_MRCC_13) W14(IO_L6P_T0_13) W15(IO_L16P_T2_13) W16(IO_L16N_T2_13) Y11(IO_L11P_T1_SRCC_13) Y12(IO_L11N_T1_SRCC_13) Y13(IO_L5P_T0_13) Y14(IO_L6N_T0_VREF_13) Y16(IO_L1P_T0_13) Y17(IO_0_13)

### Notes on the sheet
- (near IC4#1) Bank 13 is not used because it does not exist in 50T Artix version
- LVDS0 & LVDS8 must be clock capable (MRCC)
- Project/Equipment
- Document
- Designer
- Drawn by
- Check.by
- Copyright WUT ISE 2018.
  This documentation describes Open Hardware and is licensed under the CERN OHL v.1.1. You may redistribute and modify this documentation under the terms of the CERN OHL v.1.1. (http://ohwr.org/CERNOHL). This documentation is distributed WITHOUT ANY EXPRESS OR IMPLIED WARRANTY, INCLUDING OF MERCHANTABILITY, SATISFACTORY QUALITY AND FITNESS FOR A PARTICULAR PURPOSE. Please see the CERN OHL v.1.1 for applicable conditions.
- Contact
- File
- Last Mod.
- Print Date
- Sheet
- Size
- A3
- of
- Rev
- (in symbol CMP-0364-00028-3, part A) BANK 13
- (in symbol CMP-0364-00028-3, part B) BANK 14
- (in symbol R0402_1K_1%_0.0625W_100PPM) 1%

### Library data of the parts
B3-B8 = SMD_PAD_D1MM: as B9 on sheet DAC; Part Number: SMD_PAD_D1MM; Component Kind: Standard (No BOM); Component Type: Standard (No BOM); Pin Count: 1; Family: SMD Pad; Socket: No; SMD: No; Sense: No; Status: None; ComponentHeight: 0mm; HelpURL: Undefined; Author: CERN DEM JLC; CreateDate: 10.10.2017; LatestRevisionDate: 10.10.2017; PackageDescription: 1mm Diameter SMD Pad
IC4#1 = CMP-0364-00028-3: Artix-7 FPGA, 285 User I/Os, 4 GTP, 484-Ball BGA, Speed Grade 3, Extended Grade, Pb-Free; Manufacturer: Xilinx; Max User I/O: 300; Clock Mgmt Tiles (CMTs): 6; Logic Cells: 101440; Block RAM Blocks (36Kb): 135; Block RAM Blocks (18Kb): 270; Speed Grade: -3; CLBs (Slices): 15850; Block RAM Blocks (Max Kb): 4860; DSP48E1 Slices: 240; RoHS: Pb-Free; ComponentLink3URL: http://www.xilinx.com/support/documentation/data_sheets/ds181_Artix_7_Data_Sheet.pdf; NexusDeviceID: XC7A100T-3FGG484E; DatasheetVersion: v1.12; Mounting Technology: Surface Mount; PackageDescription: Wire-Bond Fine-Pitch BGA, Body 23 x 23 mm, 1.0 mm Pitch; PackageReference: FGG484; ComponentLink2Description: Package Specification; Code_JEDEC: MS-034-AAJ-1; ComponentLink2URL: http://www.xilinx.com/support/documentation/user_guides/ug475_7Series_Pkg_Pinout.pdf; ComponentLink3Description: DC and Switching Characteristics; Generic Part Number: XC7A100T; ComponentLink4Description: Package File; ComponentLink4URL: http://www.xilinx.com/support/packagefiles/a7packages/xc7a100tfgg484pkg.txt; ComponentLink1URL: http://www.xilinx.com/support/documentation/data_sheets/ds180_7Series_Overview.pdf; PartNumber: XC7A100T-3FGG484E; ComponentLink5URL: http://www.xilinx.com/support/documentation/user_guides/ug475_7Series_Pkg_Pinout.pdf; PackageVersion: Rev 1.8; ComponentLink5Description: Packaging and Pinout; ComponentLink1Description: Datasheet; CLBs (Max Distributed RAM Kb): 1188
R42 R43 = R0402_1K_1%_0.0625W_100PPM: Resistor - 1%; Part Description: General Purpose Thick Film Chip Resistor; Manufacturer: GENERIC; Manufacturer1 Part Number: 232270671002L; TC: ±100ppm/°C; PressFit: No; Part Number: R0402_1K_1%_0.0625W_100PPM; Component Kind: Standard; Component Type: Standard; Pin Count: 2; Value: 1k; Status: Not Recommended; Power: 0.0625W; Tolerance: ±1%; Manufacturer Part Number: R0402_1K_1%_0.0625W_100PPM; Case: 0402; Mounted: Yes; Sense: No; Socket: No; SMD: Yes; Manufacturer1 Example: YAGEO PHYCOMP; Manufacturer1 ComponentHeight: 0.4mm; HelpURL: \\cern.ch\dfs\Applications\Altium\Datasheets\R0402_Phycomp_RC0402.pdf; Author: CERN DEM JLC; CreateDate: 03.12.2007; LatestRevisionDate: 17.10.2012; ClassName: Artix